# EAGLE design SDT Neon Predradnik (EAGLE 7.6.0)
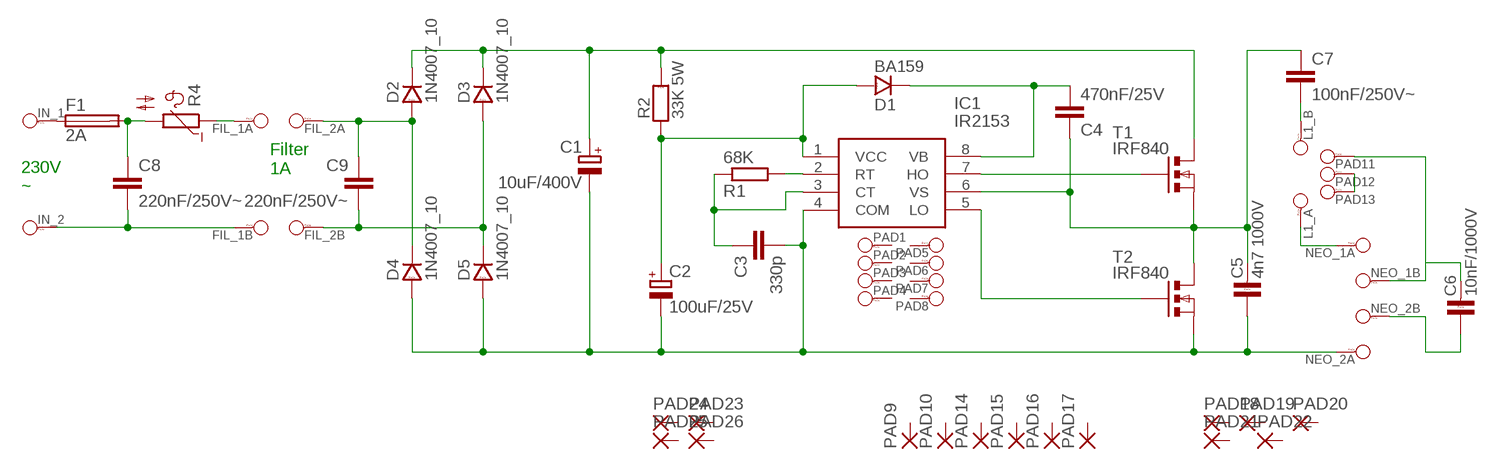
[diagram p0: schematic, sheet 1]

## Parts
C1  10uF/400V  ELEKTROLITICKYRM5-10  [ELEKTROLITICKY_RM5-10]
C2  100uF/25V  ELEKTROLITICKYRM2,5-6,3  [ELEKTROLITICKY_RM2,5-6,3]
C3  330p  KERAMICKYRM5  [KERAMICKY_RM5]
C4  470nF/25V  FOLIOVYRM5/3,5-7,2  [FOLIOVY_RM5/3,5-7,2]
C5  4n7 1000V  C-KERAMIK_7,5  [C-7,5]
C6  10nF/1000V  C-KERAMIK_10  [C-10]
C7  100nF/250V~  FOLIOVYRM15/5-18  [FOLIOVY_RM15/5-18]
C8  220nF/250V~  FOLIOVYRM15/5-18  [FOLIOVY_RM15/5-18]
C9  220nF/250V~  FOLIOVYRM15/5-18  [FOLIOVY_RM15/5-18]
D1  BA159  [D-10]
D2  1N4007_10  [D-10]
D3  1N4007_10  [D-10]
D4  1N4007_10  [D-10]
D5  1N4007_10  [D-10]
F1  2A  FUSETE5  [TE5]
FIL_1A  PAD_1---  [PAD_1---]
FIL_1B  PAD_1---  [PAD_1---]
FIL_2A  PAD_1---  [PAD_1---]
FIL_2B  PAD_1---  [PAD_1---]
IC1  IR2153  IR2153PBF  [DIP762W56P254L988H533Q8N]
IN_1  IN_~_1  PAD_1---  [PAD_1---]
IN_2  IN_~_1  PAD_1---  [PAD_1---]
L1_A  PAD_1---  [PAD_1---]
L1_B  PAD_1---  [PAD_1---]
NEO_1A  PAD_1---  [PAD_1---]
NEO_1B  PAD_1---  [PAD_1---]
NEO_2A  PAD_1---  [PAD_1---]
NEO_2B  PAD_1---  [PAD_1---]
PAD1  PAD_1---  [PAD_1---]
PAD2  PAD_1---  [PAD_1---]
PAD3  PAD_1---  [PAD_1---]
PAD4  PAD_1---  [PAD_1---]
PAD5  PAD_1---  [PAD_1---]
PAD6  PAD_1---  [PAD_1---]
PAD7  PAD_1---  [PAD_1---]
PAD8  PAD_1---  [PAD_1---]
PAD9  3,81/1,3  [3,81/1,3]
PAD10  3,81/1,3  [3,81/1,3]
PAD11  PAD_1---  [PAD_1---]
PAD12  PAD_1---  [PAD_1---]
PAD13  PAD_1---  [PAD_1---]
PAD14  3,81/1,3  [3,81/1,3]
PAD15  3,81/1,3  [3,81/1,3]
PAD16  3,81/1,3  [3,81/1,3]
PAD17  3,81/1,3  [3,81/1,3]
PAD18  2,54/1,1  [2,54/1,1]
PAD19  2,54/1,1  [2,54/1,1]
PAD20  2,54/1,1  [2,54/1,1]
PAD21  2,54/1,1  [2,54/1,1]
PAD22  2,54/1,1  [2,54/1,1]
PAD23  2,54/1,1  [2,54/1,1]
PAD24  2,54/1,1  [2,54/1,1]
PAD25  2,54/1,1  [2,54/1,1]
PAD26  2,54/1,1  [2,54/1,1]
R1  68K  R-EU_0204/5  [0204/5]
R2  33K 5W  R__5W  [R-_5W]
R4  NTC644C  [N644C]
T1  IRF840  [TO-220S]
T2  IRF840  [TO-220S]

## Nets
N$1: F1.1 IN_1.1
N$2: C8.P$1 F1.2 R4.2
N$3: C8.P$2 FIL_1B.1 IN_2.1
N$4: FIL_1A.1 R4.1
N$5: C9.P$1 D2.A D4.K FIL_2A.1
N$6: IC1.7(HO) T1.1(G)
N$7: C1.P$2(+) D2.K D3.K R2.2 T1.2(D)
N$8: C6.2 NEO_1B.1 PAD11.1
N$9: IC1.5(LO) T2.1(G)
N$10: C4.P$2 D1.K IC1.8(VB)
N$11: IC1.2(RT) R1.2
N$12: C3.P$1 IC1.3(CT) R1.1
N$13: C4.P$1 C5.2 C7.P$1 IC1.6(VS) T1.3(S) T2.2(D)
N$14: C1.P$1(-) C2.P$1(-) C3.P$2 C5.1 D4.A D5.A IC1.4(COM) NEO_2A.1 T2.3(S)
N$15: C2.P$2(+) D1.A IC1.1(VCC) R2.1
N$16: C7.P$2 L1_B.1
N$17: C6.1 NEO_2B.1
N$18: L1_A.1 NEO_1A.1
N$19: C9.P$2 D3.A D5.K FIL_2B.1
N$20: PAD12.1 PAD13.1
Unconnected: PAD1.1 PAD2.1 PAD3.1 PAD4.1 PAD5.1 PAD6.1 PAD7.1 PAD8.1 PAD9.1(P) PAD10.1(P) PAD14.1(P) PAD15.1(P) PAD16.1(P) PAD17.1(P) PAD18.1(P) PAD19.1(P) PAD20.1(P) PAD21.1(P) PAD22.1(P) PAD23.1(P) PAD24.1(P) PAD25.1(P) PAD26.1(P)

## Notes on the sheet
- Filter
  1A
- 230V
  ~

## Library data of the parts
C1 C2 = #Kondenzatory:ELEKTROLITICKY
C3 = #Kondenzatory:KERAMICKY
C4 C7-C9 = #Kondenzatory:FOLIOVY
C5 C6 = #PaJa_16:C-KERAMIK: Kondenzator - keramicky
D1 = #PaJa_16:BA159: Rychlá dioda - 1A, 1000V
D2-D5 = #PaJa_16:1N4007: Usmernovaci dioda - 1A, 1000V
F1 = fuse:FUSE: Fuse; OC_FARNELL: unknown; OC_NEWARK: unknown
FIL_1A FIL_1B FIL_2A FIL_2B IN_1 IN_2 L1_A L1_B NEO_1A NEO_1B NEO_2A NEO_2B PAD1-PAD8 PAD11-PAD13 = #PaJa_16:PAD_1---: Pajeci bod - 2,54 mm, oval
IC1 = IR2153PBF:IR2153PBF: International Rectifier IR2153PBF, Dual MOSFET Power Driver Half Bridge, 10 16.8 V, 8-Pin PDIP Source: Datasheet <https://www.infineon.com/cms/en/product/power/gate-driver-ics/?>; DESCRIPTION: International Rectifier IR2153PBF, Dual MOSFET Power Driver Half Bridge, 10 16.8 V, 8-Pin PDIP; HEIGHT: 5.33mm; MANUFACTURER_NAME: Infineon; MANUFACTURER_PART_NUMBER: IR2153PBF; MOUSER_PART_NUMBER: 942-IR2153PBF; MOUSER_PRICE-STOCK: https://www.mouser.co.uk/ProductDetail/Infineon-Technologies/IR2153PBF?qs=dQmlx5f5cRK2GcLo9UPeuQ%3D%3D
PAD9 PAD10 PAD14-PAD17 = wirepad:3,81/1,3: THROUGH-HOLE PAD
PAD18-PAD26 = wirepad:2,54/1,1: THROUGH-HOLE PAD
R1 = #Odpory:R-EU_: RESISTOR, European symbol
R2 = #PaJa_16:R: Rezistor
R4 = ptc-ntc:NTC644C: PHILIPS NTC; OC_FARNELL: unknown; OC_NEWARK: unknown
T1 T2 = #_GM99:IRF840

## Board
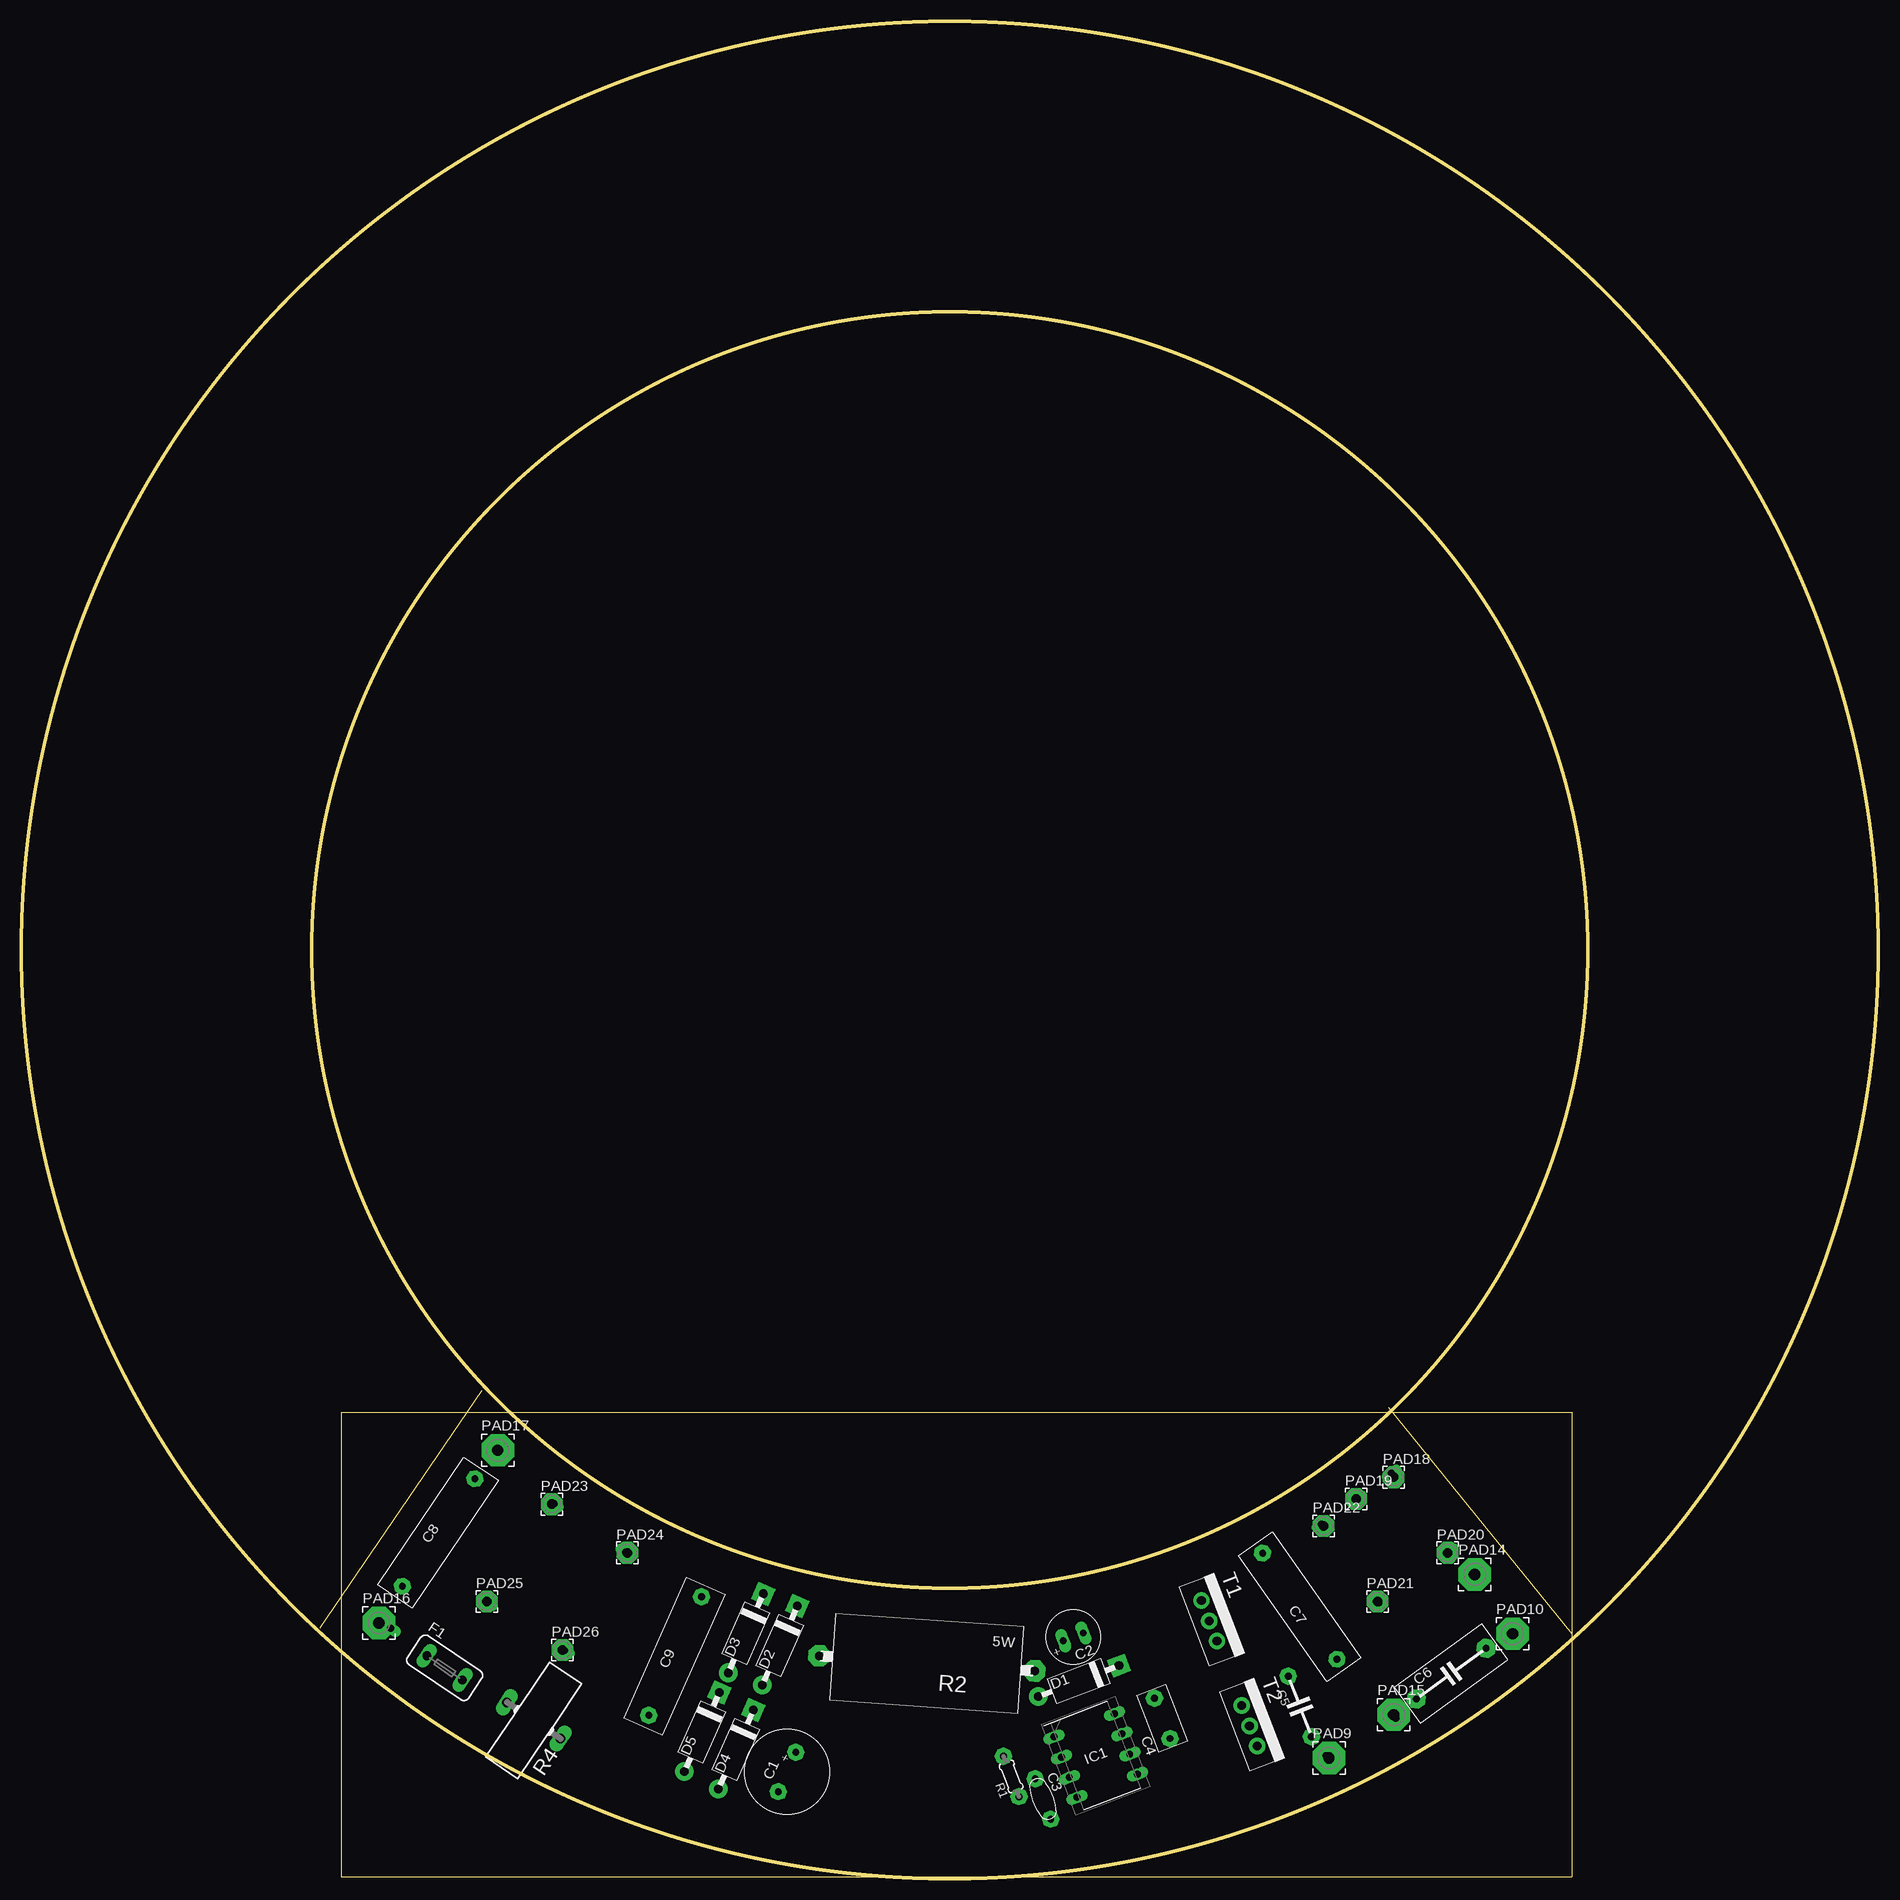
[diagram p1: board, top side]
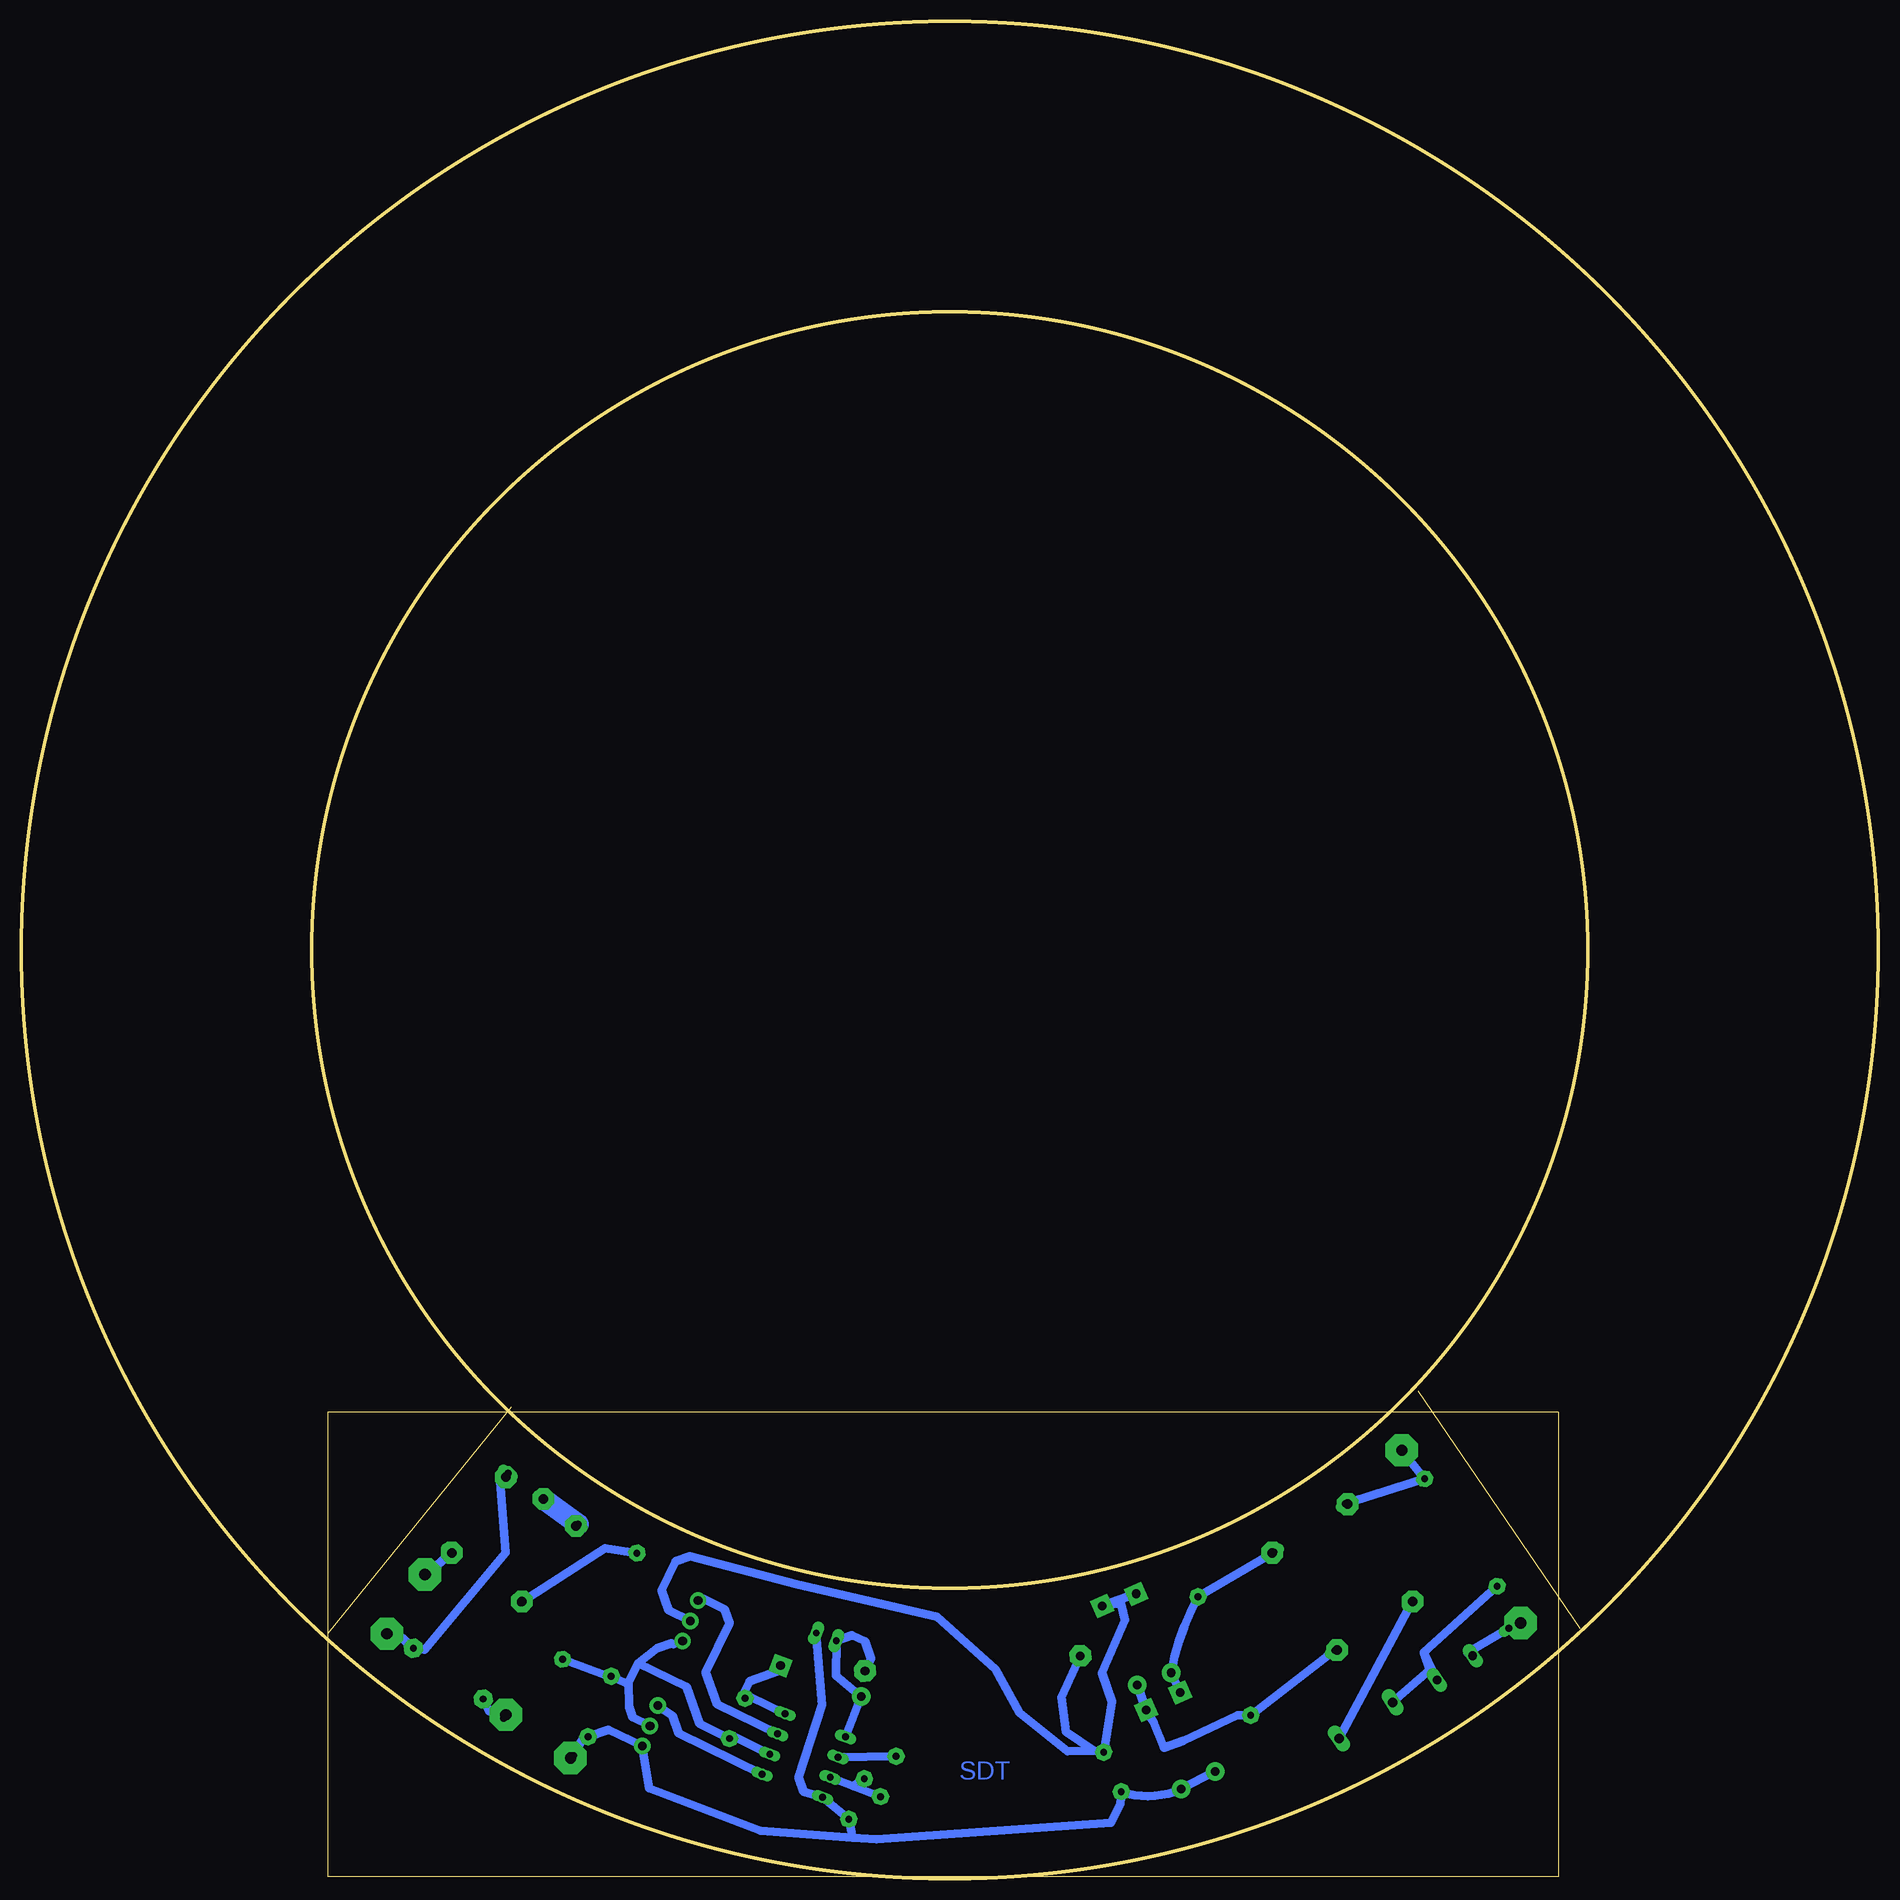
[diagram p2: board, bottom side, seen from below]

Size 218.45 x 218.45 mm. Coordinates in mm from the lower left corner, seen from the top.
Outline: 54.14,57.38 35.09,29.44
Outline: 160.82,55.48 182.41,28.81
Outline: 37.63,54.84 37.63,0.23 182.41,0.23 182.41,54.84 37.63,54.84
Outline: circle at 109.23,109.23 radius 75.03
Outline: circle at 109.23,109.23 radius 109.23
Copper layers (1*16): Top 0.035mm / dielectric 1.5mm / Bottom 0.035mm
Design rules "default": minimum track width 10mil, minimum drill 24mil, track to track 8mil, track to pad 8mil, pad to pad 8mil, via to via 8mil, smd to smd 8mil, copper to edge 40mil, drill to drill 8mil, minimum pad ring 10mil, minimum via ring 8mil, stop-mask expansion 4mil, vias tented up to drill 0mil, thermal gap 10mil

### Footprints (pad centres in the part's own frame; a part is rotated, then mirrored left to right if it is on the bottom)
ELEKTROLITICKY_RM5-10 = drill 0.8 pad 1.93 octagon: P$1 -2.54,0; P$2 2.54,0
ELEKTROLITICKY_RM2,5-6,3 = drill 0.8 pad 1.422 long: P$1 -1.27,0; P$2 1.27,0
KERAMICKY_RM5 = drill 0.8 pad 1.93 octagon: P$1 -2.54,0; P$2 2.54,0
FOLIOVY_RM5/3,5-7,2 = drill 0.8 pad 1.93 octagon: P$1 -2.54,0; P$2 2.54,0
C-7,5 = drill 0.813 pad 1.93 octagon: 1 -3.81,0; 2 3.81,0
C-10 = drill 0.813 pad 2.184 octagon: 1 -5.08,0; 2 5.08,0
FOLIOVY_RM15/5-18 = drill 0.8 pad 1.93 octagon: P$1 -7.62,0; P$2 7.62,0
D-10 = drill 1.016 pad 2.184: A -5.08,0 | drill 1.016 pad 2.184 square: K 5.08,0
TE5 = drill 1.016 long: 1 -2.54,0; 2 2.54,0
PAD_1--- = drill 0.813 pad 1.27 long: 1 0,0
DIP762W56P254L988H533Q8N = drill 0.758 pad 1.158 square: 1 -3.81,3.81 | drill 0.758 pad 1.158: 2 -3.81,1.27; 3 -3.81,-1.27; 4 -3.81,-3.81; 5 3.81,-3.81; 6 3.81,-1.27; 7 3.81,1.27; 8 3.81,3.81
3,81/1,3 = drill 1.321 pad 3.81 octagon: 1 0,0
2,54/1,1 = drill 1.118 pad 2.54 octagon: 1 0,0
0204/5 = drill 0.8 pad 1.93 octagon: 1 -2.54,0; 2 2.54,0
R-_5W = drill 1.016 pad 2.54 octagon: 1 -12.7,0; 2 12.7,0
N644C = drill 1.118 long: 1 -3.81,0; 2 3.81,0
TO-220S = drill 1.016 pad 1.93: 1 0,0; 2 2.54,0; 3 5.08,0

### Placement (x,y rotation side)
C1  90.08,12.57 66 top
C2  123.75,28.44 201 top
C3  120.18,9.38 291 top
C4  134.23,18.86 111 top
C5  150.42,20.26 111 top
C6  168.22,24.12 36 top
C7  150.41,32.05 125 top
C8  49.1,40.72 56 top
C9  76.92,26.19 66 top
D1  124.39,23.24 21 top
D2  89.24,27.44 66 top
D3  85.23,28.87 66 top
D4  84.07,15.2 66 top
D5  80.07,17.27 66 top
F1  49.81,24.81 326 top
FIL_1A  54.85,32.52 326 top
FIL_1B  62.66,44.11 326 top
FIL_2A  63.91,26.84 326 top
FIL_2B  71.09,38.42 326 top
IC1  126.39,14.49 21 top
IN_1  43.47,29.47 146 top
IN_2  56.19,50.57 146 top
L1_A  167.91,38.43 36 top
L1_B  159.69,32.46 216 top
NEO_1A  170.66,35.78 226 top
NEO_1B  175.4,29.03 136 top
NEO_2A  153.49,14.5 46 top
NEO_2B  161.71,18.88 316 top
PAD1  121.47,16.68 21 top
PAD2  122.38,14.31 21 top
PAD3  123.29,11.93 21 top
PAD4  124.2,9.56 21 top
PAD5  128.58,19.41 21 top
PAD6  129.49,17.04 21 top
PAD7  130.4,14.67 21 top
PAD8  131.31,12.29 21 top
PAD9  153.84,14.2 0 top
PAD10  175.43,28.81 0 top
PAD11  161.19,47.67 36 top
PAD12  157.08,44.69 36 top
PAD13  152.97,41.7 36 top
PAD14  170.98,35.79 0 top
PAD15  161.46,19.28 0 top
PAD16  42.08,30.08 0 top
PAD17  56.05,50.4 0 top
PAD18  161.46,47.22 0 top
PAD19  157.01,44.68 0 top
PAD20  167.81,38.33 0 top
PAD21  159.55,32.62 0 top
PAD22  153.2,41.51 0 top
PAD23  62.4,44.05 0 top
PAD24  71.29,38.33 0 top
PAD25  54.78,32.62 0 top
PAD26  63.67,26.9 0 top
R1  116.45,12.03 111 top
R2  106.53,25.33 176 top
R4  60.29,18.62 146 top
T1  138.84,32.7 291 top
T2  143.58,20.36 291 top

### Tracks (layer width: path | path; a pad name or v marks a point on that pad's centre or on a via)
N$1
  Bottom 1.016: IN_1.1 48.35,26.55 F1.1
N$2
  Bottom 1.016: F1.2 53.46,26.65 | 53.46,26.65 52.73,24.59 R4.2 | C8.P$1 53.46,26.65
N$3
  Bottom 1.016: IN_2.1 C8.P$2 FIL_1B.1
N$4
  Bottom 1.016: FIL_1A.1 R4.1
N$5
  Bottom 1.016: FIL_2A.1 C9.P$1 75.4,19.25 81.76,16.23 84.04,15.43 85.28,18.46 D4.K D2.A
N$6
  Bottom 1.016: IC1.7 136.62,20.51 137.93,24.31 135.14,30.02 135.73,31.72 138.2,32.92 T1.1
N$7
  Bottom 1.016: D3.K D2.K 89.12,32.42 88.64,30.42 91.35,24.21 90.17,20.81 C1.P$2 92.24,15.08 | R2.2 96.07,21.34 95.53,17.31 92.24,15.08 | T1.2 142.33,31.59 143.13,33.92 141.46,37.34 139.76,37.93 127.24,34.64 110.73,30.83 103.85,24.65 101.03,19.5 95.37,15.02 92.24,15.08
N$8
  Bottom 1.016: NEO_1B.1 173.64,28.37 C6.2 170.98,26.9 161.46,38.33 162.09,46.77 PAD11.1
N$9
  Bottom 1.016: IC1.5 141.14,17.09 141.85,19.16 T2.1
N$10
  Bottom 1.016: D1.K 129.46,24.38 132.8,23.23 133.51,21.78 C4.P$2 132.73,21.43 IC1.8
N$11
  Bottom 1.016: R1.2 IC1.2
N$12
  Bottom 1.016: R1.1 120.52,10.87 | 120.52,10.87 IC1.3 | C3.P$1 120.52,10.87
N$13
  Bottom 0.406: 141.93,27.68 141.74,27.59 | 147.33,22.98 147,23.09
  Bottom 1.016: C7.P$1 149.26,23.75 C5.2 147.33,22.98 | T2.2 146.54,18.98 146.97,20.25 147,23.09 145.89,25.37 | 145.89,25.37 143.63,27.1 141.93,27.68 | 141.74,27.59 T1.3 | IC1.6 134.55,16.69 C4.P$1 138.67,18.21 140.18,22.59 145.89,25.37
N$14
  Bottom 1.016: D5.A D4.A arc44 C1.P$1 89.13,8.84 90.25,6.56 117.85,4.63 120.67,4.84 | 120.67,4.84 131.49,5.63 144.61,10.62 T2.3 149.35,17.54 C5.1 152.16,16.86 NEO_2A.1 | 120.67,4.84 C3.P$2 IC1.4 126.43,10.23 127.01,11.93 124.26,20.47 C2.P$1
N$15
  Bottom 1.016: IC1.1 D1.A 122.59,23.9 C2.P$2 120.7,28.63 119.22,27.91 118.51,25.85 R2.1
N$16
  Bottom 1.016: C7.P$2 149.78,38.86 L1_B.1
N$17
  Bottom 1.016: NEO_2B.1 163.4,19.71 C6.1
N$18
  Bottom 1.016: L1_A.1 NEO_1A.1
N$19
  Bottom 1.016: FIL_2B.1 C9.P$2 arc-18 D3.A D5.K
N$20
  Bottom 2.54: PAD13.1 PAD12.1

### Text on the board
Bottom: SDT